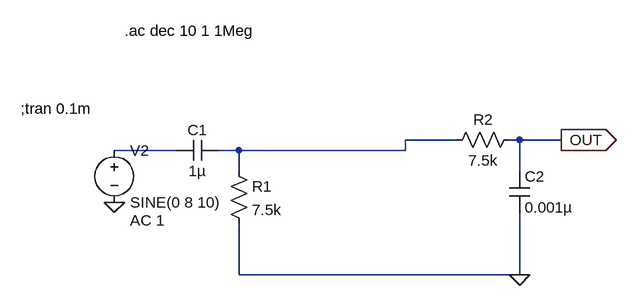
[diagram p0: schematic Filter2.asc]
Filter2.asc, the LTspice schematic file:
Version 4
SHEET 1 880 680
WIRE 384 128 304 128
WIRE 480 128 464 128
WIRE 544 128 480 128
WIRE -48 144 -144 144
WIRE 48 144 16 144
WIRE 304 144 304 128
WIRE 304 144 48 144
WIRE 48 176 48 144
WIRE 480 176 480 128
WIRE 48 336 48 256
WIRE 480 336 480 240
WIRE 480 336 48 336
FLAG 480 336 0
FLAG -144 224 0
FLAG 544 128 OUT
IOPIN 544 128 Out
SYMBOL cap 16 128 R90
WINDOW 0 0 32 VBottom 2
WINDOW 3 32 32 VTop 2
SYMATTR InstName C1
SYMATTR Value 1µ
SYMBOL res 32 160 R0
SYMATTR InstName R1
SYMATTR Value 7.5k
SYMBOL res 480 112 R90
WINDOW 0 0 56 VBottom 2
WINDOW 3 32 56 VTop 2
SYMATTR InstName R2
SYMATTR Value 7.5k
SYMBOL cap 464 176 R0
SYMATTR InstName C2
SYMATTR Value 0.001µ
SYMBOL voltage -144 128 R0
WINDOW 123 24 124 Left 2
WINDOW 39 0 0 Left 0
SYMATTR InstName V2
SYMATTR Value SINE(0 8 10)
SYMATTR Value2 AC 1
TEXT -128 -40 Left 2 !.ac dec 10 1 1Meg
TEXT -288 80 Left 2 !;tran 0.1m

The netlist it stands for:
* Filter2.asc
C1 N001 N002 1µ
R1 N001 0 7.5k
R2 OUT N001 7.5k
C2 OUT 0 0.001µ
V2 N002 0 SINE(0 8 10) AC 1
.ac dec 10 1 1Meg
;tran 0.1m
.backanno
.end